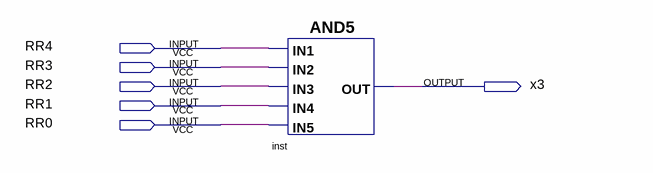
[diagram p0: schematic sheet]
// Quartus schematic KC4 (2).bdf as structural Verilog: 1 symbols, 6 pins
module \KC4_(2)  (
  input  RR4,
  input  RR3,
  input  RR2,
  input  RR1,
  input  RR0,
  output x3
);

  and inst (x3, RR4, RR3, RR2, RR1, RR0);
endmodule
